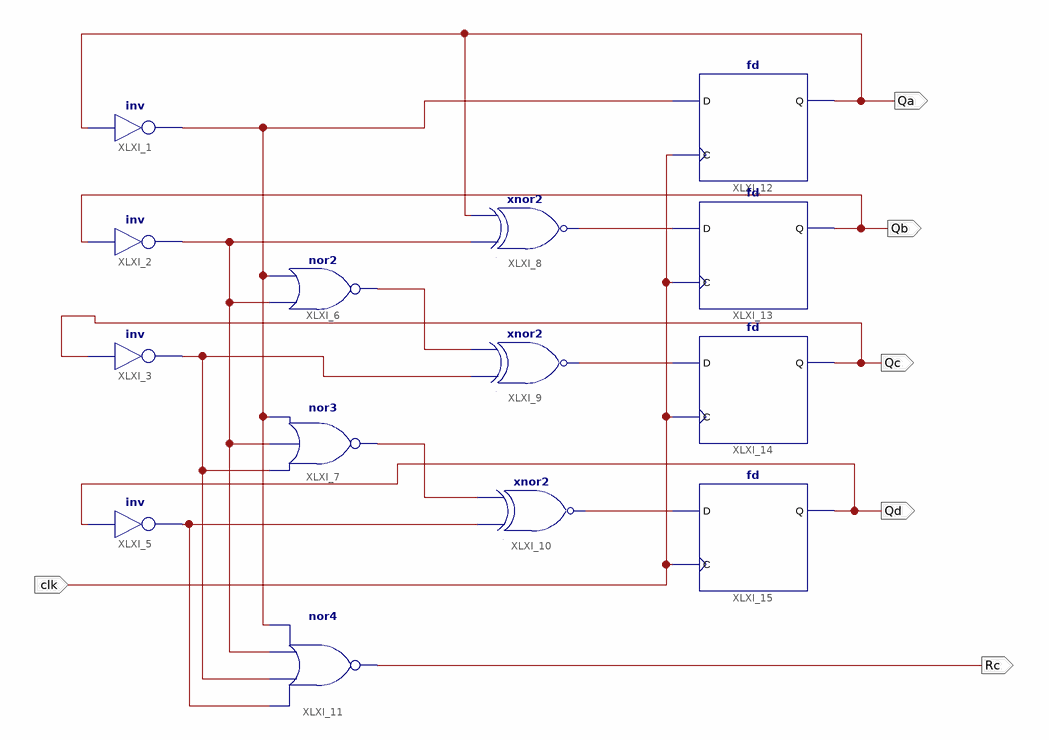
[diagram p0: schematic sheet 1]
// Xilinx ISE schematic Counter4b.sch (kintex7) as structural Verilog: 14 symbols, 6 ports
module Counter4b (
  input  clk,
  output Qa,
  output Qb,
  output Qc,
  output Qd,
  output Rc
);

  wire XLXN_8, XLXN_12, XLXN_16, XLXN_19, XLXN_26, XLXN_27, XLXN_28, XLXN_29, XLXN_30;

  not XLXI_1 (XLXN_8, Qa);
  not XLXI_2 (XLXN_12, Qb);
  not XLXI_3 (XLXN_16, Qc);
  not XLXI_5 (XLXN_19, Qd);
  nor XLXI_6 (XLXN_29, XLXN_12, XLXN_8);
  nor XLXI_7 (XLXN_30, XLXN_16, XLXN_12, XLXN_8);
  xnor XLXI_8 (XLXN_26, XLXN_12, Qa);
  xnor XLXI_9 (XLXN_27, XLXN_16, XLXN_29);
  xnor XLXI_10 (XLXN_28, XLXN_19, XLXN_30);
  nor XLXI_11 (Rc, XLXN_19, XLXN_16, XLXN_12, XLXN_8);
  fd XLXI_12 (.C(clk), .D(XLXN_8), .Q(Qa));
  fd XLXI_13 (.C(clk), .D(XLXN_26), .Q(Qb));
  fd XLXI_14 (.C(clk), .D(XLXN_27), .Q(Qc));
  fd XLXI_15 (.C(clk), .D(XLXN_28), .Q(Qd));
endmodule
